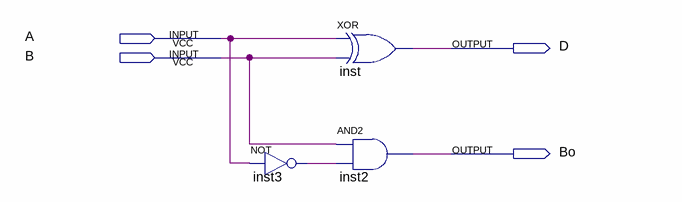
[diagram p0: schematic sheet]
// Quartus schematic projecths.bdf as structural Verilog: 3 symbols, 4 pins
module projecths (
  input  A,
  input  B,
  output D,
  output Bo
);

  wire inst3_out;

  not inst3 (inst3_out, A);
  xor inst (D, A, B);
  and inst2 (Bo, B, inst3_out);
endmodule
